# Altium schematic sheet v1.0.SchDoc
size 101 x 38 mm
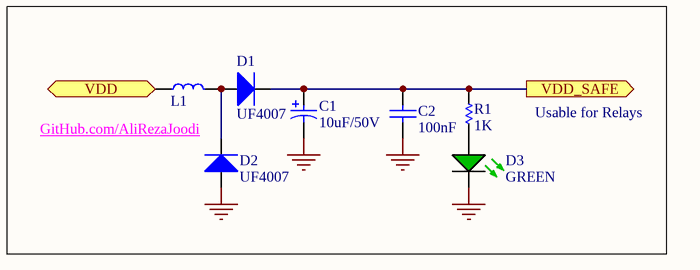
[diagram p0: v1.0.SchDoc]

## Parts
C1  10uF/50V  [C_THD_EL_(P2.54-D6-H11)]
C2  100nF  [C_THD_CER_(P2.54-D3.5-T1.5)]
D1  UF4007  [D_THD_AXIAL0.4_DO-41]
D2  UF4007  [D_THD_AXIAL0.4_DO-41]
D3  GREEN  [LED_THD_5MM_GREEN]
L1  (no value)
R1  1K  [R_THD_AXIAL0.4(1/4W)]

## Ports
VDD (in), VDD_SAFE (out)

## Nets
GND: C1.2 C2.2 D2.1(A) D3.2(K)
VDD: L1.1 ; port VDD
VDD_SAFE: C1.1 C2.1 D1.2(K) R1.2 ; port VDD_SAFE
NetD1_1: D1.1(A) D2.2(K) L1.2
NetD3_1: D3.1(A) R1.1

## Notes on the sheet
- Usable for Relays
- GitHub.com/AliRezaJoodi

## Library data of the parts
C1 = Capacitor_Electrolytic: Capacitor, Electrolytic; Revision: July-2002: Re-released for DXP Platform.
C2 = Capacitor_Ceramic: Capacitor, Ceramic Multilayer; Revision: July-2002: Re-released for DXP Platform.
D1 D2 = Diode: Diode,; Revision: July-2002: Re-released for DXP Platform.
D3 = LED_GREEN: LED, Green; Manufacturer: Generic Components; Class I: Optoelectronic; Published: 8-Jun-2000; Revision: July-2002: Re-released for DXP Platform.; Publisher: Altium Limited; Class II: LED
L1 = Inductor_2Type: Inductor,
R1 = Resistor: Revision: July-2002: Re-released for DXP Platform.